# EasyEDA schematic Controller.json
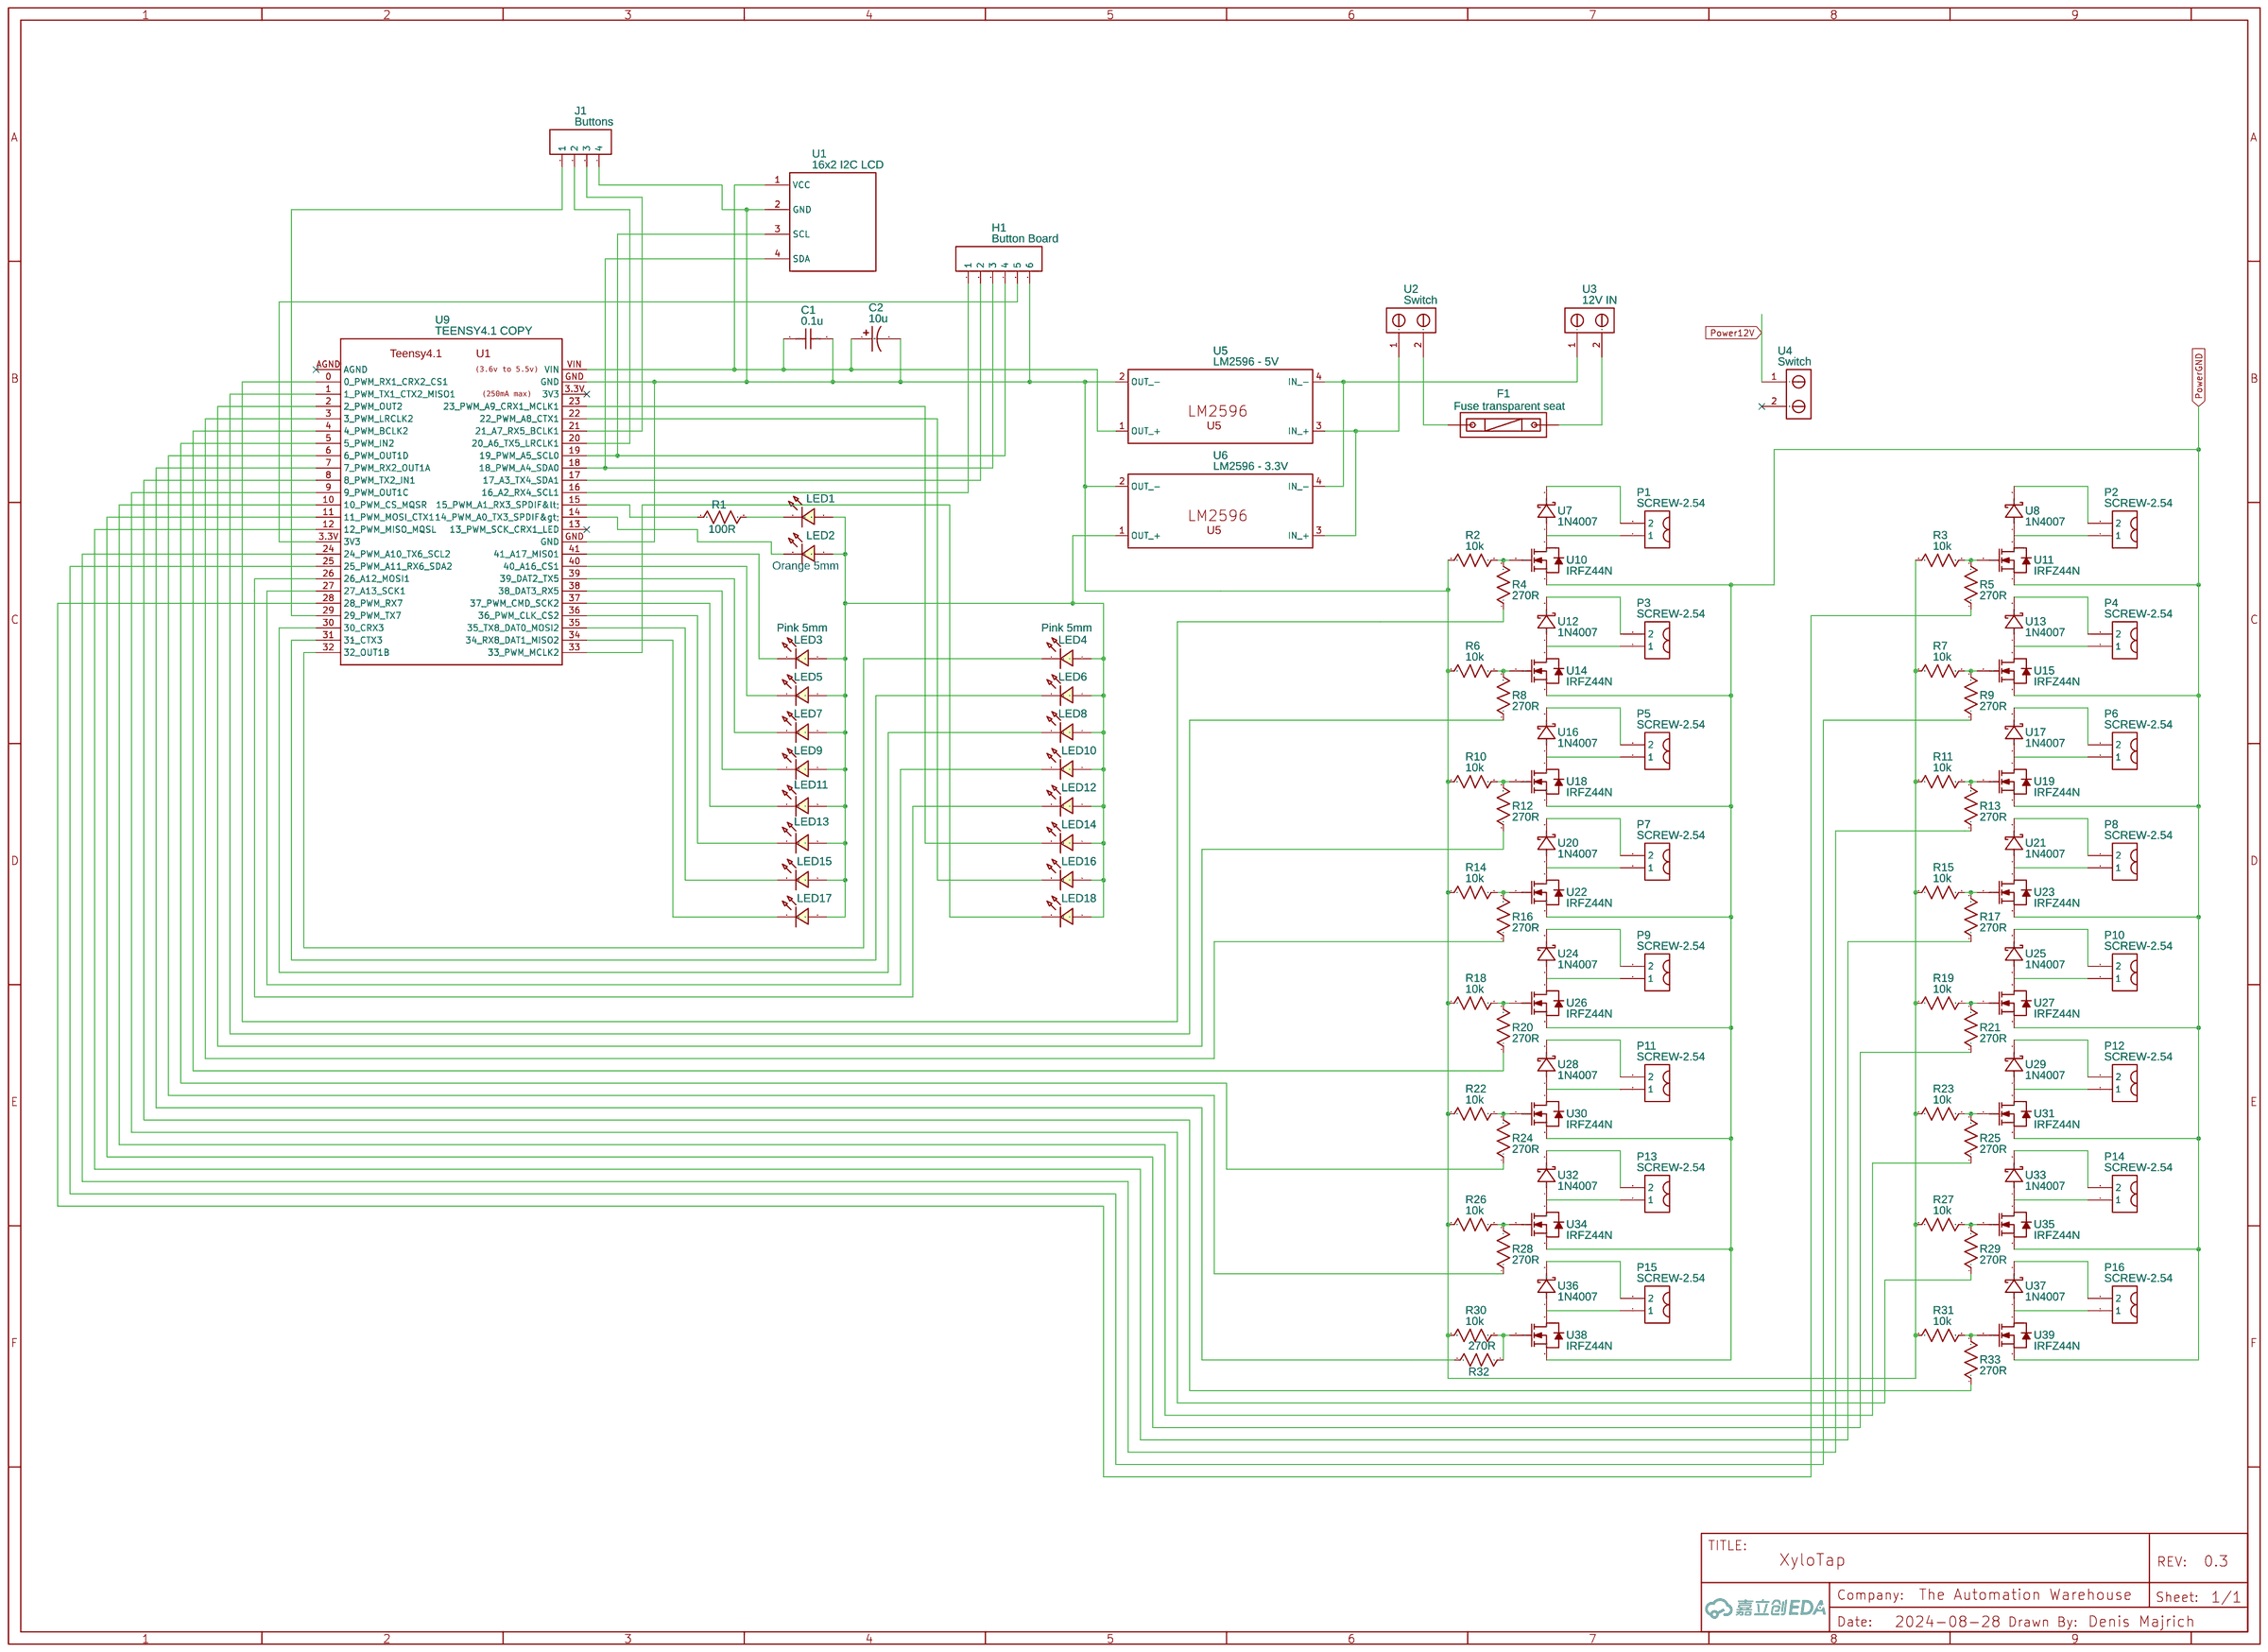
[diagram p0: schematic sheet]

## Parts
C1  0.1u  [RAD-0.1]
C2  10u  [CAP-D5.0×F2.0]
F1  Fuse transparent seat  [FUSE-TH_L24.5-W9.8-P22.5]
H1  Button Board  [HDR-F-2.54_1X6]
J1  Buttons  [HDR-M-2.54_1X4]
LED1  Pink 5mm  [LED-TH_BD5.0_BLUE]
LED2  Pink 5mm  [LED-TH_BD5.0_BLUE]
LED3  Pink 5mm  [LED-TH_BD5.0_BLUE]
LED4  Pink 5mm  [LED-TH_BD5.0_BLUE]
LED5  Pink 5mm  [LED-TH_BD5.0_BLUE]
LED6  Pink 5mm  [LED-TH_BD5.0_BLUE]
LED7  Pink 5mm  [LED-TH_BD5.0_BLUE]
LED8  Pink 5mm  [LED-TH_BD5.0_BLUE]
LED9  Pink 5mm  [LED-TH_BD5.0_BLUE]
LED10  Pink 5mm  [LED-TH_BD5.0_BLUE]
LED11  Pink 5mm  [LED-TH_BD5.0_BLUE]
LED12  Pink 5mm  [LED-TH_BD5.0_BLUE]
LED13  Pink 5mm  [LED-TH_BD5.0_BLUE]
LED14  Pink 5mm  [LED-TH_BD5.0_BLUE]
LED15  Pink 5mm  [LED-TH_BD5.0_BLUE]
LED16  Pink 5mm  [LED-TH_BD5.0_BLUE]
LED17  Pink 5mm  [LED-TH_BD5.0_BLUE]
LED18  Pink 5mm  [LED-TH_BD5.0_BLUE]
P1  SCREW-2.54  [PCBSCREW-2.54-2P]
P2  SCREW-2.54  [PCBSCREW-2.54-2P]
P3  SCREW-2.54  [PCBSCREW-2.54-2P]
P4  SCREW-2.54  [PCBSCREW-2.54-2P]
P5  SCREW-2.54  [PCBSCREW-2.54-2P]
P6  SCREW-2.54  [PCBSCREW-2.54-2P]
P7  SCREW-2.54  [PCBSCREW-2.54-2P]
P8  SCREW-2.54  [PCBSCREW-2.54-2P]
P9  SCREW-2.54  [PCBSCREW-2.54-2P]
P10  SCREW-2.54  [PCBSCREW-2.54-2P]
P11  SCREW-2.54  [PCBSCREW-2.54-2P]
P12  SCREW-2.54  [PCBSCREW-2.54-2P]
P13  SCREW-2.54  [PCBSCREW-2.54-2P]
P14  SCREW-2.54  [PCBSCREW-2.54-2P]
P15  SCREW-2.54  [PCBSCREW-2.54-2P]
P16  SCREW-2.54  [PCBSCREW-2.54-2P]
R1  100R  [R_AXIAL-0.4]
R2  10k  [R_AXIAL-0.4]
R3  10k  [R_AXIAL-0.4]
R4  270R  [R_AXIAL-0.4]
R5  270R  [R_AXIAL-0.4]
R6  10k  [R_AXIAL-0.4]
R7  10k  [R_AXIAL-0.4]
R8  270R  [R_AXIAL-0.4]
R9  270R  [R_AXIAL-0.4]
R10  10k  [R_AXIAL-0.4]
R11  10k  [R_AXIAL-0.4]
R12  270R  [R_AXIAL-0.4]
R13  270R  [R_AXIAL-0.4]
R14  10k  [R_AXIAL-0.4]
R15  10k  [R_AXIAL-0.4]
R16  270R  [R_AXIAL-0.4]
R17  270R  [R_AXIAL-0.4]
R18  10k  [R_AXIAL-0.4]
R19  10k  [R_AXIAL-0.4]
R20  270R  [R_AXIAL-0.4]
R21  270R  [R_AXIAL-0.4]
R22  10k  [R_AXIAL-0.4]
R23  10k  [R_AXIAL-0.4]
R24  270R  [R_AXIAL-0.4]
R25  270R  [R_AXIAL-0.4]
R26  10k  [R_AXIAL-0.4]
R27  10k  [R_AXIAL-0.4]
R28  270R  [R_AXIAL-0.4]
R29  270R  [R_AXIAL-0.4]
R30  10k  [R_AXIAL-0.4]
R31  10k  [R_AXIAL-0.4]
R32  270R  [R_AXIAL-0.4]
R33  270R  [R_AXIAL-0.4]
U1  16x2 I2C LCD  [I2CLCD16X2 NO MOUNT]
U2  Switch  [TERMINAL_X2_5MM]
U3  12V IN  [TERMINAL_X2_5MM]
U4  Switch  [TERMINAL_X2_5MM]
U5  LM2596 - 5V  [LM2596ALEX]
U6  LM2596 - 3.3V  [LM2596ALEX]
U7  1N4007  [DO-41_BD2.4-L4.7-P8.70-D0.8-FD]
U8  1N4007  [DO-41_BD2.4-L4.7-P8.70-D0.8-FD]
U9  TEENSY4.1 COPY  [TEENSY4.1]
U10  IRFZ44N  [TO-220-3_L9.9-W4.5-P2.54-L]
U11  IRFZ44N  [TO-220-3_L9.9-W4.5-P2.54-L]
U12  1N4007  [DO-41_BD2.4-L4.7-P8.70-D0.8-FD]
U13  1N4007  [DO-41_BD2.4-L4.7-P8.70-D0.8-FD]
U14  IRFZ44N  [TO-220-3_L9.9-W4.5-P2.54-L]
U15  IRFZ44N  [TO-220-3_L9.9-W4.5-P2.54-L]
U16  1N4007  [DO-41_BD2.4-L4.7-P8.70-D0.8-FD]
U17  1N4007  [DO-41_BD2.4-L4.7-P8.70-D0.8-FD]
U18  IRFZ44N  [TO-220-3_L9.9-W4.5-P2.54-L]
U19  IRFZ44N  [TO-220-3_L9.9-W4.5-P2.54-L]
U20  1N4007  [DO-41_BD2.4-L4.7-P8.70-D0.8-FD]
U21  1N4007  [DO-41_BD2.4-L4.7-P8.70-D0.8-FD]
U22  IRFZ44N  [TO-220-3_L9.9-W4.5-P2.54-L]
U23  IRFZ44N  [TO-220-3_L9.9-W4.5-P2.54-L]
U24  1N4007  [DO-41_BD2.4-L4.7-P8.70-D0.8-FD]
U25  1N4007  [DO-41_BD2.4-L4.7-P8.70-D0.8-FD]
U26  IRFZ44N  [TO-220-3_L9.9-W4.5-P2.54-L]
U27  IRFZ44N  [TO-220-3_L9.9-W4.5-P2.54-L]
U28  1N4007  [DO-41_BD2.4-L4.7-P8.70-D0.8-FD]
U29  1N4007  [DO-41_BD2.4-L4.7-P8.70-D0.8-FD]
U30  IRFZ44N  [TO-220-3_L9.9-W4.5-P2.54-L]
U31  IRFZ44N  [TO-220-3_L9.9-W4.5-P2.54-L]
U32  1N4007  [DO-41_BD2.4-L4.7-P8.70-D0.8-FD]
U33  1N4007  [DO-41_BD2.4-L4.7-P8.70-D0.8-FD]
U34  IRFZ44N  [TO-220-3_L9.9-W4.5-P2.54-L]
U35  IRFZ44N  [TO-220-3_L9.9-W4.5-P2.54-L]
U36  1N4007  [DO-41_BD2.4-L4.7-P8.70-D0.8-FD]
U37  1N4007  [DO-41_BD2.4-L4.7-P8.70-D0.8-FD]
U38  IRFZ44N  [TO-220-3_L9.9-W4.5-P2.54-L]
U39  IRFZ44N  [TO-220-3_L9.9-W4.5-P2.54-L]

## Library data of the parts
C1 = C_RAD-0.1_US: Contributor: LCEDA_Lib
C2 = CE_TH_D5.0×F2.0_US: Contributor: LCEDA_Lib
F1 = Fuse transparent seat: Supplier: LCSC; Manufacturer: xcfuse(旭程); Supplier Part: C58066; JLCPCB Part Class: Extended Part
H1 = HDR-F-2.54_1x6: Supplier Part: C40877; Supplier: LCSC; Contributor: LCEDA_Lib
J1 = HDR-M-2.54_1x4: Supplier Part: C124378; Supplier: LCSC; Contributor: LCEDA_Lib
LED1-LED18 = LED-TH-5mm_B: Supplier: LCSC; Contributor: LCEDA_Lib
P1-P16 = PCBSCREW-2.54-2P: Contributor: marceloncosta
R1-R33 = R_AXIAL-0.4_US: Contributor: LCEDA_Lib
U1 = 16x2 i2c LCD no mount on PCB: Contributor: edgm
U2-U4 = Terminal_x2_5mm: Contributor: ianpcrawford
U5 U6 = LM2596ALEX: Contributor: Pegasik76
U7 U8 U12 U13 U16 U17 U20 U21 U24 U25 U28 U29 U32 U33 U36 U37 = 1N4007-DIODE: Contributor: LCSC; Supplier: LCSC; Supplier Part: C9900005663; Manufacturer: null
U9 = TEENSY4.1 COPY: Manufacturer: PJRC; Manufacturer Part: Teensy4.1; link: https://www.pjrc.com/store/teensy41.html; Contributor: laserline2000
U10 U11 U14 U15 U18 U19 U22 U23 U26 U27 U30 U31 U34 U35 U38 U39 = IRFZ44N: Contributor: lcsc; Supplier: LCSC; Supplier Part: C7429904; Manufacturer: minos(迈诺斯); JLCPCB Part Class: Extended Part

## Nets
Power12V: U4.1
PowerGND: U10.3(S) U11.3(S) U14.3(S) U15.3(S) U18.3(S) U19.3(S) U22.3(S) U23.3(S) U26.3(S) U27.3(S) U30.3(S) U31.3(S) U34.3(S) U35.3(S) U38.3(S) U39.3(S)
Net-(C1-1): C1.1 C2.1 U1.1(VCC) U5.1(OUT +) U9.VIN
Net-(C1-2): C1.2 C2.2 H1.6 J1.4 R2.1 R3.1 R6.1 R7.1 R10.1 R11.1 R14.1 R15.1 R18.1 R19.1 R22.1 R23.1 R26.1 R27.1 R30.1 R31.1 U1.2(GND) U5.2(OUT -) U6.2(OUT -) U9.GND
Net-(F1-1): F1.1 U3.2
Net-(F1-2): F1.2 U2.2
Net-(H1-1): H1.1 U9.16(16_A2_RX4_SCL1)
Net-(H1-2): H1.2 U9.17(17_A3_TX4_SDA1)
Net-(H1-3): H1.3 U1.4(SDA) U9.18(18_PWM_A4_SDA0)
Net-(H1-4): H1.4 U1.3(SCL) U9.19(19_PWM_A5_SCL0)
Net-(H1-5): H1.5 U9.3.3V(3V3)
Net-(J1-1): J1.1 U9.29(29_PWM_TX7)
Net-(J1-2): J1.2 U9.20(20_A6_TX5_LRCLK1)
Net-(J1-3): J1.3 U9.21(21_A7_RX5_BCLK1)
Net-(LED1-1): LED1.1 LED2.1 LED3.1 LED4.1 LED5.1 LED6.1 LED7.1 LED8.1 LED9.1 LED10.1 LED11.1 LED12.1 LED13.1 LED14.1 LED15.1 LED16.1 LED17.1 LED18.1 U6.1(OUT +)
Net-(LED1-2): LED1.2 R1.2
Net-(LED2-2): LED2.2 U9.14(14_PWM_A0_TX3_SPDIF>)
Net-(LED3-2): LED3.2 U9.41(41_A17_MIS01)
Net-(LED4-2): LED4.2 U9.32(32_OUT1B)
Net-(LED5-2): LED5.2 U9.40(40_A16_CS1)
Net-(LED6-2): LED6.2 U9.31(31_CTX3)
Net-(LED7-2): LED7.2 U9.39(39_DAT2_TX5)
Net-(LED8-2): LED8.2 U9.30(30_CRX3)
Net-(LED9-2): LED9.2 U9.38(38_DAT3_RX5)
Net-(LED10-2): LED10.2 U9.27(27_A13_SCK1)
Net-(LED11-2): LED11.2 U9.37(37_PWM_CMD_SCK2)
Net-(LED12-2): LED12.2 U9.26(26_A12_MOSI1)
Net-(LED13-2): LED13.2 U9.36(36_PWM_CLK_CS2)
Net-(LED14-2): LED14.2 U9.23(23_PWM_A9_CRX1_MCLK1)
Net-(LED15-2): LED15.2 U9.35(35_TX8_DAT0_MOSI2)
Net-(LED16-2): LED16.2 U9.22(22_PWM_A8_CTX1)
Net-(LED17-2): LED17.2 U9.34(34_RX8_DAT1_MISO2)
Net-(LED18-2): LED18.2 U9.33(33_PWM_MCLK2)
Net-(P1-1): P1.1 U7.1(A) U10.2(D)
Net-(P1-2): P1.2 U7.2(K)
Net-(P2-1): P2.1 U8.1(A) U11.2(D)
Net-(P2-2): P2.2 U8.2(K)
Net-(P3-1): P3.1 U12.1(A) U14.2(D)
Net-(P3-2): P3.2 U12.2(K)
Net-(P4-1): P4.1 U13.1(A) U15.2(D)
Net-(P4-2): P4.2 U13.2(K)
Net-(P5-1): P5.1 U16.1(A) U18.2(D)
Net-(P5-2): P5.2 U16.2(K)
Net-(P6-1): P6.1 U17.1(A) U19.2(D)
Net-(P6-2): P6.2 U17.2(K)
Net-(P7-1): P7.1 U20.1(A) U22.2(D)
Net-(P7-2): P7.2 U20.2(K)
Net-(P8-1): P8.1 U21.1(A) U23.2(D)
Net-(P8-2): P8.2 U21.2(K)
Net-(P9-1): P9.1 U24.1(A) U26.2(D)
Net-(P9-2): P9.2 U24.2(K)
Net-(P10-1): P10.1 U25.1(A) U27.2(D)
Net-(P10-2): P10.2 U25.2(K)
Net-(P11-1): P11.1 U28.1(A) U30.2(D)
Net-(P11-2): P11.2 U28.2(K)
Net-(P12-1): P12.1 U29.1(A) U31.2(D)
Net-(P12-2): P12.2 U29.2(K)
Net-(P13-1): P13.1 U32.1(A) U34.2(D)
Net-(P13-2): P13.2 U32.2(K)
Net-(P14-1): P14.1 U33.1(A) U35.2(D)
Net-(P14-2): P14.2 U33.2(K)
Net-(P15-1): P15.1 U36.1(A) U38.2(D)
Net-(P15-2): P15.2 U36.2(K)
Net-(P16-1): P16.1 U37.1(A) U39.2(D)
Net-(P16-2): P16.2 U37.2(K)
Net-(R1-1): R1.1 U9.15(15_PWM_A1_RX3_SPDIF<)
Net-(R2-2): R2.2 R4.2 U10.1(G)
Net-(R3-2): R3.2 R5.2 U11.1(G)
Net-(R4-1): R4.1 U9.0(0_PWM_RX1_CRX2_CS1)
Net-(R5-1): R5.1 U9.28(28_PWM_RX7)
Net-(R6-2): R6.2 R8.2 U14.1(G)
Net-(R7-2): R7.2 R9.2 U15.1(G)
Net-(R8-1): R8.1 U9.1(1_PWM_TX1_CTX2_MISO1)
Net-(R9-1): R9.1 U9.25(25_PWM_A11_RX6_SDA2)
Net-(R10-2): R10.2 R12.2 U18.1(G)
Net-(R11-2): R11.2 R13.2 U19.1(G)
Net-(R12-1): R12.1 U9.2(2_PWM_OUT2)
Net-(R13-1): R13.1 U9.24(24_PWM_A10_TX6_SCL2)
Net-(R14-2): R14.2 R16.2 U22.1(G)
Net-(R15-2): R15.2 R17.2 U23.1(G)
Net-(R16-1): R16.1 U9.3(3_PWM_LRCLK2)
Net-(R17-1): R17.1 U9.12(12_PWM_MISO_MQSL)
Net-(R18-2): R18.2 R20.2 U26.1(G)
Net-(R19-2): R19.2 R21.2 U27.1(G)
Net-(R20-1): R20.1 U9.4(4_PWM_BCLK2)
Net-(R21-1): R21.1 U9.11(11_PWM_MOSI_CTX1)
Net-(R22-2): R22.2 R24.2 U30.1(G)
Net-(R23-2): R23.2 R25.2 U31.1(G)
Net-(R24-1): R24.1 U9.5(5_PWM_IN2)
Net-(R25-1): R25.1 U9.10(10_PWM_CS_MQSR)
Net-(R26-2): R26.2 R28.2 U34.1(G)
Net-(R27-2): R27.2 R29.2 U35.1(G)
Net-(R28-1): R28.1 U9.6(6_PWM_OUT1D)
Net-(R29-1): R29.1 U9.9(9_PWM_OUT1C)
Net-(R30-2): R30.2 R32.1 U38.1(G)
Net-(R31-2): R31.2 R33.2 U39.1(G)
Net-(R32-2): R32.2 U9.7(7_PWM_RX2_OUT1A)
Net-(R33-1): R33.1 U9.8(8_PWM_TX2_IN1)
Net-(U2-1): U2.1 U5.3(IN +) U6.3(IN +)
Net-(U3-1): U3.1 U5.4(IN -) U6.4(IN -)

Not connected (* = marked no-connect by the designer): U4 2*; U9 13(13_PWM_SCK_CRX1_LED)* AGND*

## Notes on the sheet
- Orange 5mm
